# Altium schematic sheet ADC088S022.SchDoc
size A4; SheetNumber: 8; SheetTotal: 9
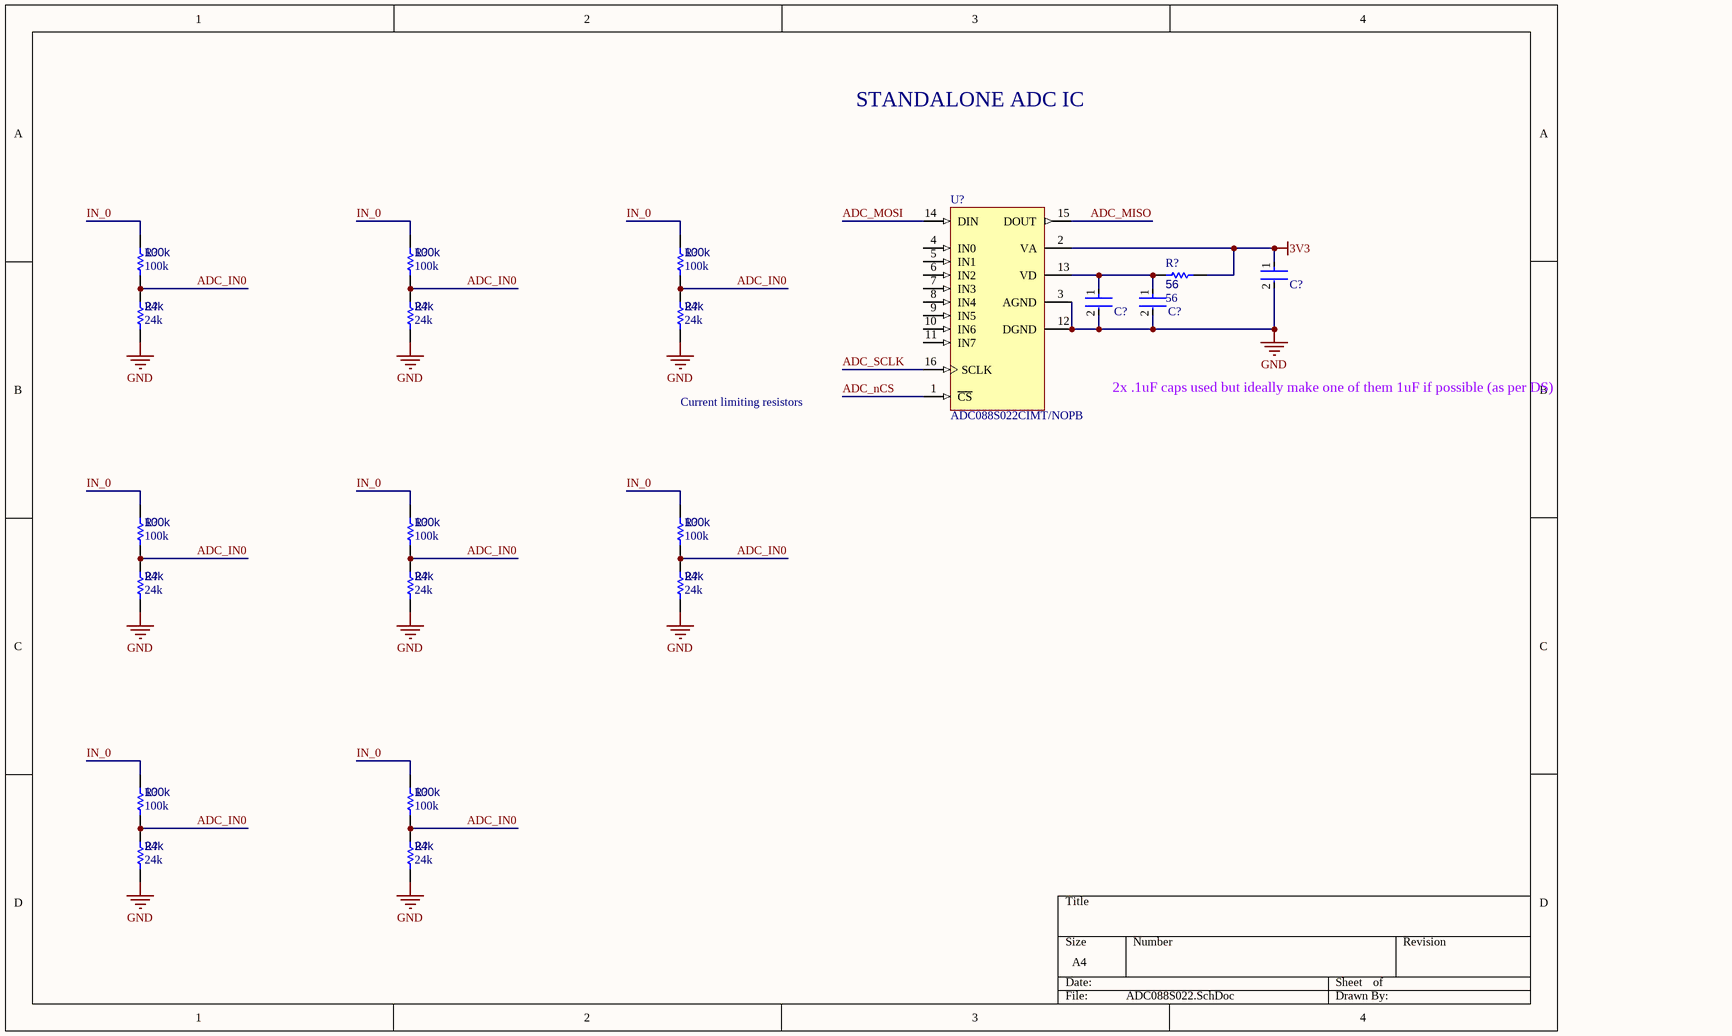
[diagram p0: ADC088S022.SchDoc]

## Parts
(Parts that share a designator on the sheet are numbered #1, #2 ... from top to bottom, then left to right.)
C?#1  C0402C104K8PACTU  [FP-C0402-BB-MFG]  (value not drawn)
C?#2  C0402C104K8PACTU  [FP-C0402-BB-MFG]  (value not drawn)
C?#3  C0402C104K8PACTU  [FP-C0402-BB-MFG]  (value not drawn)
R?#1  100k  [R0603B]
R?#2  100k  [R0603B]
R?#3  100k  [R0603B]
R?#4  56  [R0603B]
R?#5  24k  [R0603B]
R?#6  24k  [R0603B]
R?#7  24k  [R0603B]
R?#8  100k  [R0603B]
R?#9  100k  [R0603B]
R?#10  100k  [R0603B]
R?#11  24k  [R0603B]
R?#12  24k  [R0603B]
R?#13  24k  [R0603B]
R?#14  100k  [R0603B]
R?#15  100k  [R0603B]
R?#16  24k  [R0603B]
R?#17  24k  [R0603B]
U?  ADC088S022CIMT/NOPB  [MTC16_L]

## Nets
3V3: C?#1.1 R?#4.1 U?.2(VA)
GND: C?#1.2 C?#2.2 C?#3.2 R?#5.1 R?#6.1 R?#7.1 R?#11.1 R?#12.1 R?#13.1 R?#16.1 R?#17.1 U?.3(AGND) U?.12(DGND)
ADC_IN0: R?#1.1 R?#2.1 R?#3.1 R?#5.2 R?#6.2 R?#7.2 R?#8.1 R?#9.1 R?#10.1 R?#11.2 R?#12.2 R?#13.2 R?#14.1 R?#15.1 R?#16.2 R?#17.2
ADC_MISO: U?.15(DOUT)
ADC_MOSI: U?.14(DIN)
ADC_nCS: U?.1(~{CS})
ADC_SCLK: U?.16(SCLK)
IN_0: R?#1.2 R?#2.2 R?#3.2 R?#8.2 R?#9.2 R?#10.2 R?#14.2 R?#15.2
NetC?#2_1: C?#2.1 C?#3.1 R?#4.2 U?.13(VD)

Not connected (* = marked no-connect by the designer): U? 4(IN0) 5(IN1) 6(IN2) 7(IN3) 8(IN4) 9(IN5) 10(IN6) 11(IN7)

## Notes on the sheet
- STANDALONE ADC IC
- Current limiting resistors
- 2x .1uF caps used but ideally make one of them 1uF if possible (as per DS)

## Library data of the parts
C?#1-C?#3 = CMP-2008-02046-2: CAP CER 0.1UF 10V X5R 0402; Manufacturer: Kemet; Material: Ceramic; Capacitance: 0.10 μF; Temperature Coefficient: 15%; Tolerance: 0.1; Value: 0.10 μF; Package: C0402-BB; Temperature: -55°C to +125°C; ComponentLink2Description: Datasheet; Temperature Characteristic: X5R; Device Class L1: Passive Components; Height: 0.55mm; Lead Free: Yes; ComponentLink2URL: https://content.kemet.com/datasheets/KEM_C1002_X7R_SMD.pdf; Device Class L2: Capacitors; Temperature Range Low: -55°C; Temperature Range High: +125°C; RoHS: TRUE; Octopart: https://octopart.com/c0402c104k8pactu-kemet-140039; Automotive: No; Mouser Description: Capacitor 100 nF 10 VDC 0402; Category: Cap; Voltage Rating: 10 V; Digikey Description: CAP CER 0.1UF 10V X5R 0402; Ipc Land Pattern Name: CAPC10050X50; Device Class L3: Ceramic Capacitors; Manufacturer Part Number: C0402C104K8PACTU
R?#1-R?#17 = CMP-009-00002-14: Resistor
  R?#1-R?#3 R?#8-R?#10 R?#14 R?#15: Value: 100k
  R?#4: Value: 56
  R?#5-R?#7 R?#11-R?#13 R?#16 R?#17: Value: 24k
U? = CMP-0054-00372-2: 8-Channel, 50 kSPS to 200 kSPS, 8-Bit A/D Converter, 16-pin TSSOP, Pb-Free; Manufacturer: National Semiconductor; PackageTopMarking: NSUZXYTT*88S022*CIMT; CompType: ADC IC; PowerWise: Y; ComponentLink2URL: http://www.national.com/pf/AD/ADC088S022.html; RoHS: Y; PackageDescription: Molded TSSOP, Jedec, 5 x 4.4 x 0.9mm Body, 16 Lead, 0.65mm Pitch; DatasheetVersion: Feb-2010; PinCount: 16; ComponentLink1Description: ADC088S022 Datasheet; Code_JEDEC: MO-153-AB; ComponentLink3URL: http://www.national.com/packaging/folders/mtc16.html; PackageVersion: revD, Jun-2003; ComponentLink3Description: MTC16 Package Page; RevisionNote: Component URLs added; ComponentLink1URL: http://www.national.com/ds/AD/ADC088S022.pdf; ComponentLink2Description: ADC088S022 Web Page; PackageReference: MTC16